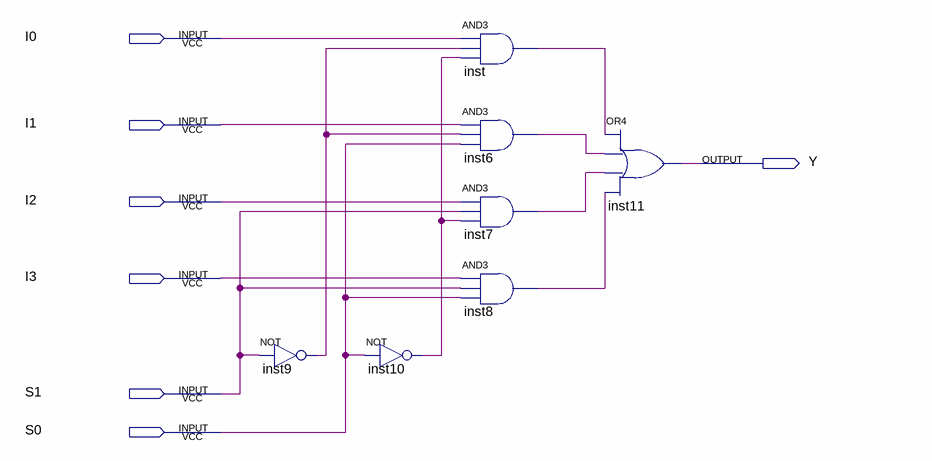
[diagram p0: schematic sheet]
// Quartus schematic 1131417_Lab1-3.bdf as structural Verilog: 7 symbols, 7 pins
module \1131417_Lab1-3  (
  input  I0,
  input  I1,
  input  I2,
  input  I3,
  input  S1,
  input  S0,
  output Y
);

  wire inst6_out, inst7_out, inst8_out, inst9_out, inst10_out, inst_out;

  not inst9 (inst9_out, S1);
  not inst10 (inst10_out, S0);
  and inst (inst_out, I0, inst9_out, inst10_out);
  and inst6 (inst6_out, I1, inst9_out, S0);
  and inst7 (inst7_out, I2, S1, inst10_out);
  and inst8 (inst8_out, I3, S1, S0);
  or inst11 (Y, inst_out, inst6_out, inst7_out, inst8_out);
endmodule
